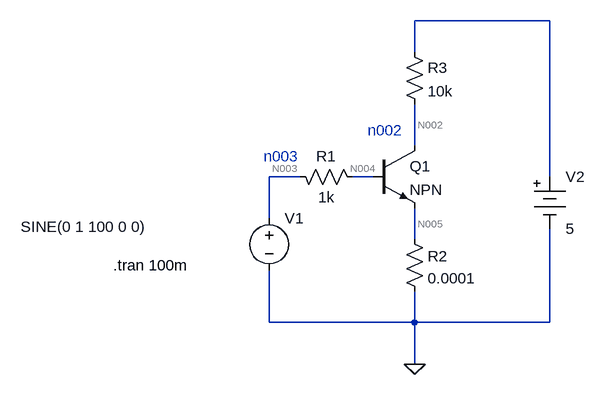
[diagram p0: schematic Yoneda-p102__Transistor_Amplify__v1_Plain.asc]
Yoneda-p102__Transistor_Amplify__v1_Plain.asc, the LTspice schematic file:
Version 4
SHEET 1 880 680
WIRE 496 -176 288 -176
WIRE 288 -128 288 -176
WIRE 288 16 288 -48
WIRE 112 64 64 64
WIRE 224 64 192 64
WIRE 496 64 496 -176
WIRE 64 128 64 64
WIRE 288 160 288 112
WIRE 64 288 64 208
WIRE 288 288 288 240
WIRE 288 288 64 288
WIRE 496 288 496 144
WIRE 496 288 288 288
WIRE 288 352 288 288
FLAG 288 352 0
SYMBOL res 208 80 M270
WINDOW 0 32 56 VTop 2
WINDOW 3 0 56 VBottom 2
SYMATTR InstName R1
SYMATTR Value 1k
SYMBOL res 272 144 R0
WINDOW 0 36 42 Left 2
SYMATTR InstName R2
SYMATTR Value 0.0001
SYMBOL Misc\\battery 496 48 R0
SYMATTR InstName V2
SYMATTR Value 5
SYMBOL npn 224 16 R0
SYMATTR InstName Q1
SYMBOL voltage 64 112 R0
WINDOW 3 -382 29 Left 2
WINDOW 123 0 0 Left 2
WINDOW 39 0 0 Left 2
SYMATTR Value SINE(0 1 100 0 0)
SYMATTR InstName V1
SYMBOL res 272 -144 R0
SYMATTR InstName R3
SYMATTR Value 10k
TEXT -176 200 Left 2 !.tran 100m
TEXT 56 32 Left 2 ;n003
TEXT 216 -8 Left 2 ;n002

The netlist it stands for:
* Yoneda-p102__Transistor_Amplify__v1_Plain.asc
R1 N004 N003 1k
R2 N005 0 0.0001
V2 N001 0 5
Q1 N002 N004 N005 0 NPN
V1 N003 0 SINE(0 1 100 0 0)
R3 N001 N002 10k
.model NPN NPN
.model PNP PNP
.lib standard.bjt
.tran 100m
* n003
* n002
.backanno
.end

* Results of the author's LTspice run, read from the files saved beside the schematic
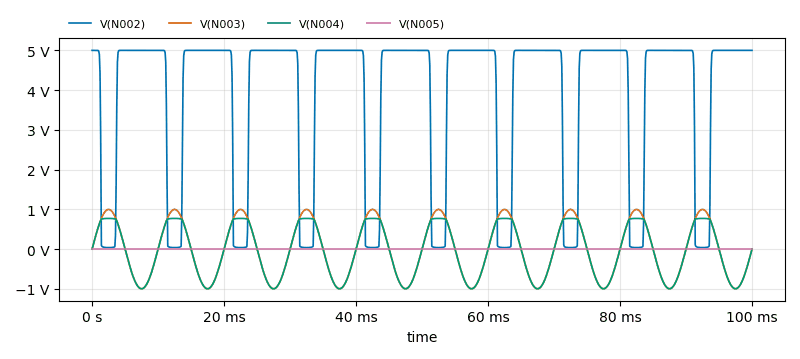
[diagram p1: Transient Analysis of Yoneda-p102__Transistor_Amplify__v1_Plain.asc, plotted from the saved traces]
* Transient Analysis, 1 run:
*   V(N002): min 37.62 mV, max 5 V, average 3.817 V, rms 4.335 V, last 5 V
*   V(N003): min -999.1 mV, max 999.1 mV, average 288.6 µV, rms 706.6 mV, last 0 V
*   V(N004): min -999.1 mV, max 772.4 mV, average -33.8 mV, rms 663.9 mV, last 0 V
*   V(N005): min 0 V, max 72.29 nV, average 15.24 nV, rms 31 nV, last 0 V